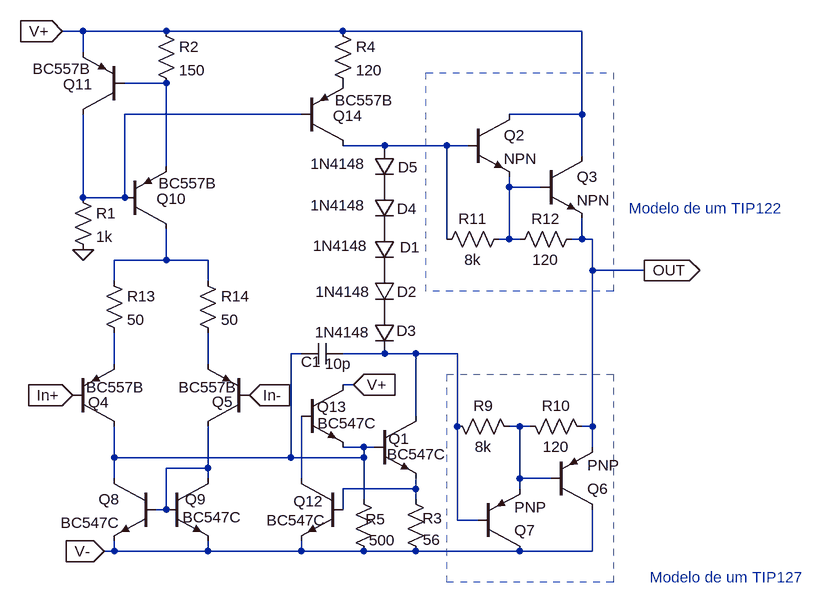
[diagram p0: schematic G_CC-CE.asc]
G_CC-CE.asc, the LTspice schematic file:
Version 4.1
SHEET 1 1376 680
WIRE -80 -416 -112 -416
WIRE 48 -416 -80 -416
WIRE 320 -416 48 -416
WIRE 688 -416 320 -416
WIRE -80 -384 -80 -416
WIRE 48 -336 -16 -336
WIRE 256 -288 -16 -288
WIRE 688 -288 688 -416
WIRE 688 -288 576 -288
WIRE 384 -240 320 -240
WIRE 480 -240 384 -240
WIRE 512 -240 480 -240
WIRE 688 -224 688 -288
WIRE 48 -208 48 -336
WIRE 576 -176 576 -192
WIRE 624 -176 576 -176
WIRE -80 -160 -80 -288
WIRE -16 -160 -16 -288
WIRE -16 -160 -80 -160
WIRE 480 -96 480 -240
WIRE 576 -96 576 -176
WIRE 576 -96 560 -96
WIRE 592 -96 576 -96
WIRE 688 -96 688 -128
WIRE 688 -96 672 -96
WIRE 704 -96 688 -96
WIRE 48 -64 48 -112
WIRE 48 -64 -32 -64
WIRE 112 -64 48 -64
WIRE 704 -48 704 -96
WIRE 784 -48 704 -48
WIRE -32 -32 -32 -64
WIRE 112 -32 112 -64
WIRE 256 80 240 80
WIRE 384 80 320 80
WIRE 432 80 384 80
WIRE 496 80 432 80
WIRE -32 96 -32 48
WIRE 112 96 112 48
WIRE 336 128 320 128
WIRE 432 176 432 80
WIRE 496 192 496 80
WIRE 592 192 576 192
WIRE 608 192 592 192
WIRE 704 192 704 -48
WIRE 704 192 688 192
WIRE 352 224 320 224
WIRE 368 224 352 224
WIRE 704 224 704 192
WIRE -32 240 -32 192
WIRE 240 240 240 80
WIRE 240 240 -32 240
WIRE 352 240 352 224
WIRE 352 240 240 240
WIRE 112 256 112 192
WIRE 112 256 48 256
WIRE -32 272 -32 240
WIRE 112 272 112 256
WIRE 256 272 256 176
WIRE 592 272 592 192
WIRE 640 272 592 272
WIRE 432 288 432 272
WIRE 432 288 320 288
WIRE 592 288 592 272
WIRE 352 304 352 240
WIRE 432 304 432 288
WIRE 48 320 48 256
WIRE 48 320 32 320
WIRE 320 320 320 288
WIRE 496 336 496 192
WIRE 528 336 496 336
WIRE -32 384 -32 368
WIRE -32 384 -48 384
WIRE 112 384 112 368
WIRE 112 384 -32 384
WIRE 256 384 256 368
WIRE 256 384 112 384
WIRE 352 384 256 384
WIRE 432 384 352 384
WIRE 592 384 432 384
WIRE 704 384 704 320
WIRE 704 384 592 384
FLAG -112 -416 V+
IOPIN -112 -416 In
FLAG -48 384 V-
IOPIN -48 384 In
FLAG -96 144 In+
IOPIN -96 144 In
FLAG 176 144 In-
IOPIN 176 144 In
FLAG 784 -48 OUT
IOPIN 784 -48 Out
FLAG -80 -80 0
FLAG 336 128 V+
IOPIN 336 128 In
SYMBOL pnp -96 192 M180
WINDOW 3 21 60 Left 2
WINDOW 0 24 37 Left 2
SYMATTR Value BC557B
SYMATTR InstName Q4
SYMBOL pnp 176 192 R180
WINDOW 3 20 60 Left 2
WINDOW 0 25 38 Left 2
SYMATTR Value BC557B
SYMATTR InstName Q5
SYMBOL res 304 -432 R0
SYMATTR InstName R4
SYMATTR Value 120
SYMBOL res 480 176 M90
WINDOW 0 0 56 VBottom 2
WINDOW 3 32 56 VTop 2
SYMATTR InstName R9
SYMATTR Value 8k
SYMBOL res 592 176 M90
WINDOW 0 0 56 VBottom 2
WINDOW 3 32 56 VTop 2
SYMATTR InstName R10
SYMATTR Value 120
SYMBOL npn 512 -288 R0
SYMATTR InstName Q2
SYMBOL npn 624 -224 R0
SYMATTR InstName Q3
SYMBOL res 464 -80 R270
WINDOW 0 32 56 VTop 2
WINDOW 3 0 56 VBottom 2
SYMATTR InstName R11
SYMATTR Value 8k
SYMBOL res 576 -80 R270
WINDOW 0 32 56 VTop 2
WINDOW 3 0 56 VBottom 2
SYMATTR InstName R12
SYMATTR Value 120
SYMBOL pnp 640 320 M180
SYMATTR InstName Q6
SYMBOL pnp 528 384 M180
SYMATTR InstName Q7
SYMBOL cap 320 64 R90
WINDOW 0 44 49 VBottom 2
WINDOW 3 16 7 VTop 2
SYMATTR InstName C1
SYMATTR Value 10p
SYMBOL diode 368 -112 R0
WINDOW 0 40 28 Left 2
WINDOW 3 -94 26 Left 2
SYMATTR InstName D1
SYMATTR Value 1N4148
SYMBOL diode 368 -48 R0
WINDOW 0 35 33 Left 2
WINDOW 3 -90 33 Left 2
SYMATTR InstName D2
SYMATTR Value 1N4148
SYMBOL diode 368 16 R0
WINDOW 0 34 29 Left 2
WINDOW 3 -91 31 Left 2
SYMATTR InstName D3
SYMATTR Value 1N4148
SYMBOL diode 368 -176 R0
WINDOW 0 35 33 Left 2
WINDOW 3 -98 28 Left 2
SYMATTR InstName D4
SYMATTR Value 1N4148
SYMBOL diode 368 -240 R0
WINDOW 0 37 33 Left 2
WINDOW 3 -98 28 Left 2
SYMATTR InstName D5
SYMATTR Value 1N4148
SYMBOL res -48 -48 R0
SYMATTR InstName R13
SYMATTR Value 50
SYMBOL res 96 -48 R0
SYMATTR InstName R14
SYMATTR Value 50
SYMBOL npn 32 272 M0
SYMATTR InstName Q8
SYMATTR Value BC547C
SYMBOL npn 48 272 R0
WINDOW 0 29 32 Left 2
WINDOW 3 25 60 Left 2
SYMATTR InstName Q9
SYMATTR Value BC547C
SYMBOL res -96 -176 R0
SYMATTR InstName R1
SYMATTR Value 1k
SYMBOL pnp -16 -112 M180
WINDOW 3 52 70 Left 2
WINDOW 0 49 46 Left 2
SYMATTR Value BC557B
SYMATTR InstName Q10
SYMBOL res 32 -432 R0
SYMATTR InstName R2
SYMATTR Value 150
SYMBOL pnp -16 -288 R180
WINDOW 3 52 70 Left 2
WINDOW 0 49 46 Left 2
SYMATTR Value BC557B
SYMATTR InstName Q11
SYMBOL pnp 256 -240 M180
WINDOW 3 52 70 Left 2
WINDOW 0 49 46 Left 2
SYMATTR Value BC557B
SYMATTR InstName Q14
SYMBOL npn 368 176 R0
WINDOW 0 22 35 Left 2
WINDOW 3 20 59 Left 2
SYMATTR InstName Q1
SYMATTR Value BC547C
SYMBOL res 416 288 R0
WINDOW 0 26 45 Left 2
WINDOW 3 27 78 Left 2
SYMATTR InstName R3
SYMATTR Value 56
SYMBOL npn 320 272 M0
WINDOW 0 30 35 Left 2
WINDOW 3 27 64 Left 2
SYMATTR InstName Q12
SYMATTR Value BC547C
SYMBOL res 336 288 R0
WINDOW 0 19 47 Left 2
WINDOW 3 24 79 Left 2
SYMATTR InstName R5
SYMATTR Value 500
SYMBOL npn 256 128 R0
WINDOW 0 24 34 Left 2
WINDOW 3 25 59 Left 2
SYMATTR InstName Q13
SYMATTR Value BC547C
TEXT 760 -144 Left 2 ;Modelo de um TIP122
TEXT 792 424 Left 2 ;Modelo de um TIP127
RECTANGLE Normal 736 -16 448 -352 2
RECTANGLE Normal 736 432 480 112 2

The netlist it stands for:
* G_CC-CE.asc
Q4 N006 In+ N008 0 BC557B
Q5 N011 In- N009 0 BC557B
R4 V+ P001 120
R9 N007 N010 8k
R10 N010 OUT 120
Q2 V+ N003 N004 0 NPN
Q3 V+ N004 OUT 0 NPN
R11 N003 N004 8k
R12 N004 OUT 120
Q6 V- N010 OUT 0 PNP
Q7 V- N007 N010 0 PNP
C1 N007 N006 10p
D1 P002 P003 1N4148
D2 P003 P004 1N4148
D3 P004 N007 1N4148
D4 P005 P002 1N4148
D5 N003 P005 1N4148
R13 N005 N008 50
R14 N005 N009 50
Q8 N006 N011 V- 0 BC547C
Q9 N011 N011 V- 0 BC547C
R1 N002 0 1k
Q10 N005 N002 N001 0 BC557B
R2 V+ N001 150
Q11 N002 N001 V+ 0 BC557B
Q14 N003 N002 P001 0 BC557B
Q1 N007 N006 N013 0 BC547C
R3 N013 V- 56
Q12 N012 N013 V- 0 BC547C
R5 N006 V- 500
Q13 V+ N012 N006 0 BC547C
.model D D
.lib standard.dio
.model NPN NPN
.model PNP PNP
.lib standard.bjt
* Modelo de um TIP122
* Modelo de um TIP127
.backanno
.end